# Altium schematic sheet Sensores_3.SchDoc
size A4
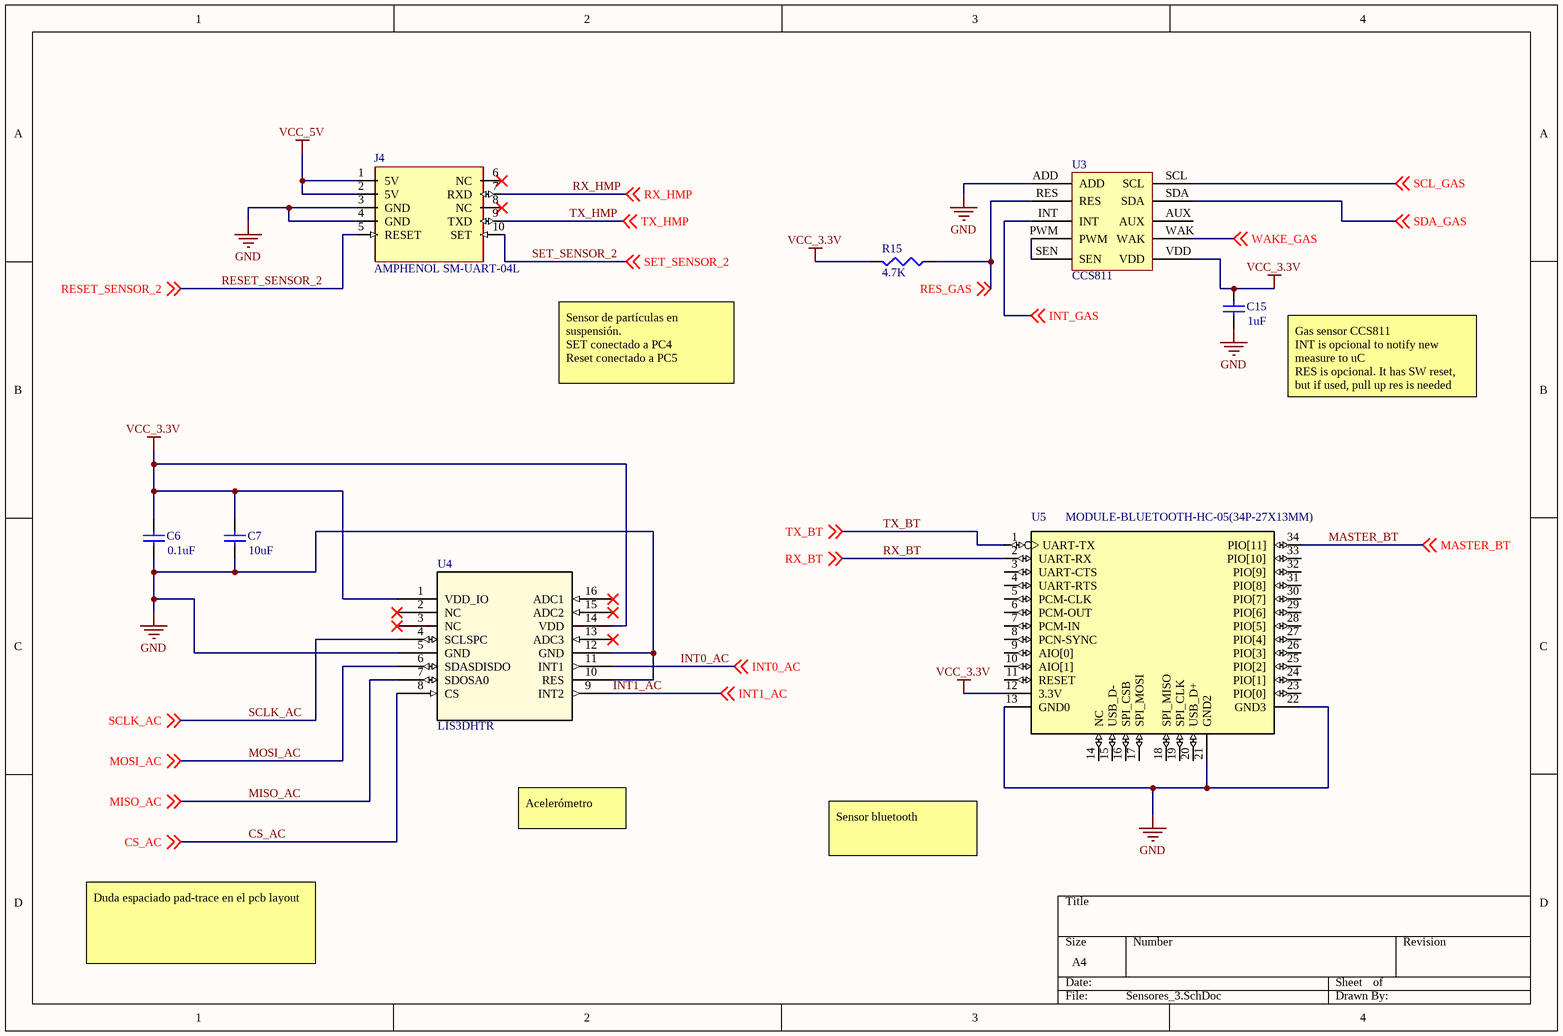
[diagram p0: Sensores_3.SchDoc]

## Parts
C6  value 0.1uF  [0603]  (hidden comment: Cap)
C7  value 10uF  [0603]  (hidden comment: Cap)
C15  value 1uF  [0603]  (hidden comment: Cap)
J4  AMPHENOL SM-UART-04L  [PM SENSOR]
R15  value 4.7K  [0603]  (hidden comment: Res3)
U3  CCS811  [CCS811]
U4  LIS3DHTR  [LIS3DHTR]
U5  MODULE-BLUETOOTH-HC-05(34P-27X13MM)  [HC-05]

## Nets
GND: C6.1 C7.1 C15.1 J4.3(GND) J4.4(GND) U3.ADD U4.5(GND) U4.10(RES) U4.12(GND) U5.13(GND0) U5.21(GND2) U5.22(GND3)
VCC_3.3V: C6.2 C7.2 C15.2 R15.2 U3.VDD U4.1(VDD_IO) U4.14(VDD) U5.12(3.3V)
VCC_5V: J4.1(5V) J4.2(5V)
CS_AC: U4.8(CS) ; off-sheet CS_AC
INT0_AC: U4.11(INT1) ; off-sheet INT0_AC
INT1_AC: U4.9(INT2) ; off-sheet INT1_AC
INT_GAS: U3.INT ; off-sheet INT_GAS
MASTER_BT: U5.34(PIO[11]) ; off-sheet MASTER_BT
MISO_AC: U4.7(SDOSA0) ; off-sheet MISO_AC
MOSI_AC: U4.6(SDASDISDO) ; off-sheet MOSI_AC
RES_GAS: R15.1 U3.RES ; off-sheet RES_GAS
RESET_SENSOR_2: J4.5(RESET) ; off-sheet RESET_SENSOR_2
RX_BT: U5.2(UART-RX) ; off-sheet RX_BT
RX_HMP: J4.7(RXD) ; off-sheet RX_HMP
SCL_GAS: U3.SCL ; off-sheet SCL_GAS
SCLK_AC: U4.4(SCLSPC) ; off-sheet SCLK_AC
SDA_GAS: U3.SDA ; off-sheet SDA_GAS
SET_SENSOR_2: J4.10(SET) ; off-sheet SET_SENSOR_2
TX_BT: U5.1(UART-TX) ; off-sheet TX_BT
TX_HMP: J4.9(TXD) ; off-sheet TX_HMP
WAKE_GAS: U3.WAK ; off-sheet WAKE_GAS
NetU3_PWM: U3.PWM U3.SEN

Not connected (* = marked no-connect by the designer): J4 6(NC)* 8(NC)*; U3 AUX; U4 2(NC)* 3(NC)* 13(ADC3)* 15(ADC2)* 16(ADC1)*; U5 3(UART-CTS) 4(UART-RTS) 5(PCM-CLK) 6(PCM-OUT) 7(PCM-IN) 8(PCN-SYNC) 9(AIO[0]) 10(AIO[1]) 11(RESET) 14(NC) 15(USB_D-) 16(SPI_CSB) 17(SPI_MOSI) 18(SPI_MISO) 19(SPI_CLK) 20(USB_D+) 23(PIO[0]) 24(PIO[1]) 25(PIO[2]) 26(PIO[3]) 27(PIO[4]) 28(PIO[5]) 29(PIO[6]) 30(PIO[7]) 31(PIO[8]) 32(PIO[9]) 33(PIO[10])

## Notes on the sheet
- Sensor de partículas en suspensión.                                 SET conectado a PC4
  Reset conectado a PC5
- Gas sensor CCS811
  INT is opcional to notify new measure to uC
  RES is opcional. It has SW reset, but if used, pull up res is needed
- Acelerómetro
- Sensor bluetooth
- Duda espaciado pad-trace en el pcb layout

## Library data of the parts
C6 C7 C15 = Cap_0603: Capacitor; Published: 8-Jun-2000; LatestRevisionDate: 17-Jul-2002; LatestRevisionNote: Re-released for DXP Platform.; PackageReference: RAD-0.3; Publisher: Altium Limited; PackageDescription: Radial Cap, Thru-Hole; 2 Leads; 0.3 in Pin Spacing; Supplier 1: RSComponents; Supplier 2: Digi-Key
  C6: Supplier Part Number 1: 8015205; Supplier Part Number 2: 399-1095-1-ND
  C7: Supplier Part Number 1: 7882893; Supplier Part Number 2: 445-7486-1-ND
  C15: Supplier Part Number 1: 4612708; Supplier Part Number 2: 478-1251-1-ND
J4 = AMPHENOL: Supplier 1: Mouser; Supplier Part Number 1: 527-SM-UART-04L; Supplier 2: Digi-Key; Supplier Part Number 2: 235-1590-ND; Supplier 3: RSComponents; Supplier Part Number 3: 7679066; Supplier 4: Digi-Key; Supplier Part Number 4: SAM9874-ND
R15 = Res3: Resistor; Published: 8-Jun-2000; LatestRevisionDate: 29-May-2009; LatestRevisionNote: IPC-7351 Footprint Added.; PackageReference: J1-0603; Publisher: Altium Limited; PackageDescription: Chip Resistor; Supplier 1: RSComponents; Supplier Part Number 1: 8206865; Supplier 2: Digi-Key; Supplier Part Number 2: P4.70KHCT-ND
U4 = LIS3DHTR: Imported; Vendor: STMicroelectronics; Built_By: EMA_UL_Team; C: Copyright (C) 2015 Accelerated Designs. All rights reserved; Manufacturer_Part_Number: LIS3DHTR; RefDes: RefDes; Type: DEV; Value: Value; Supplier 1: RSComponents; Supplier Part Number 1: 7931364; Supplier 2: Digi-Key; Supplier Part Number 2: 497-10613-6-ND
U5 = HC-05 (Bluetooth module): Modulo bluetooth, 34 pin; MF: Texas Instruments; MP: HC05; Package: None; Availability: Unavailable; Price: None; SnapEDA_Link: https://www.snapeda.com/parts/HC05/Texas%20Instruments/view-part/?ref=snap; Value: *
U3 = CCS811: Supplier 1: Mouser; Supplier Part Number 1: 985-CCS811B-JOPR5K; Supplier 2: Digi-Key; Supplier Part Number 2: CCS811B-JOPR5KCT-ND